# EAGLE design imon (EAGLE 7.7.0)
REVISION: 1.2
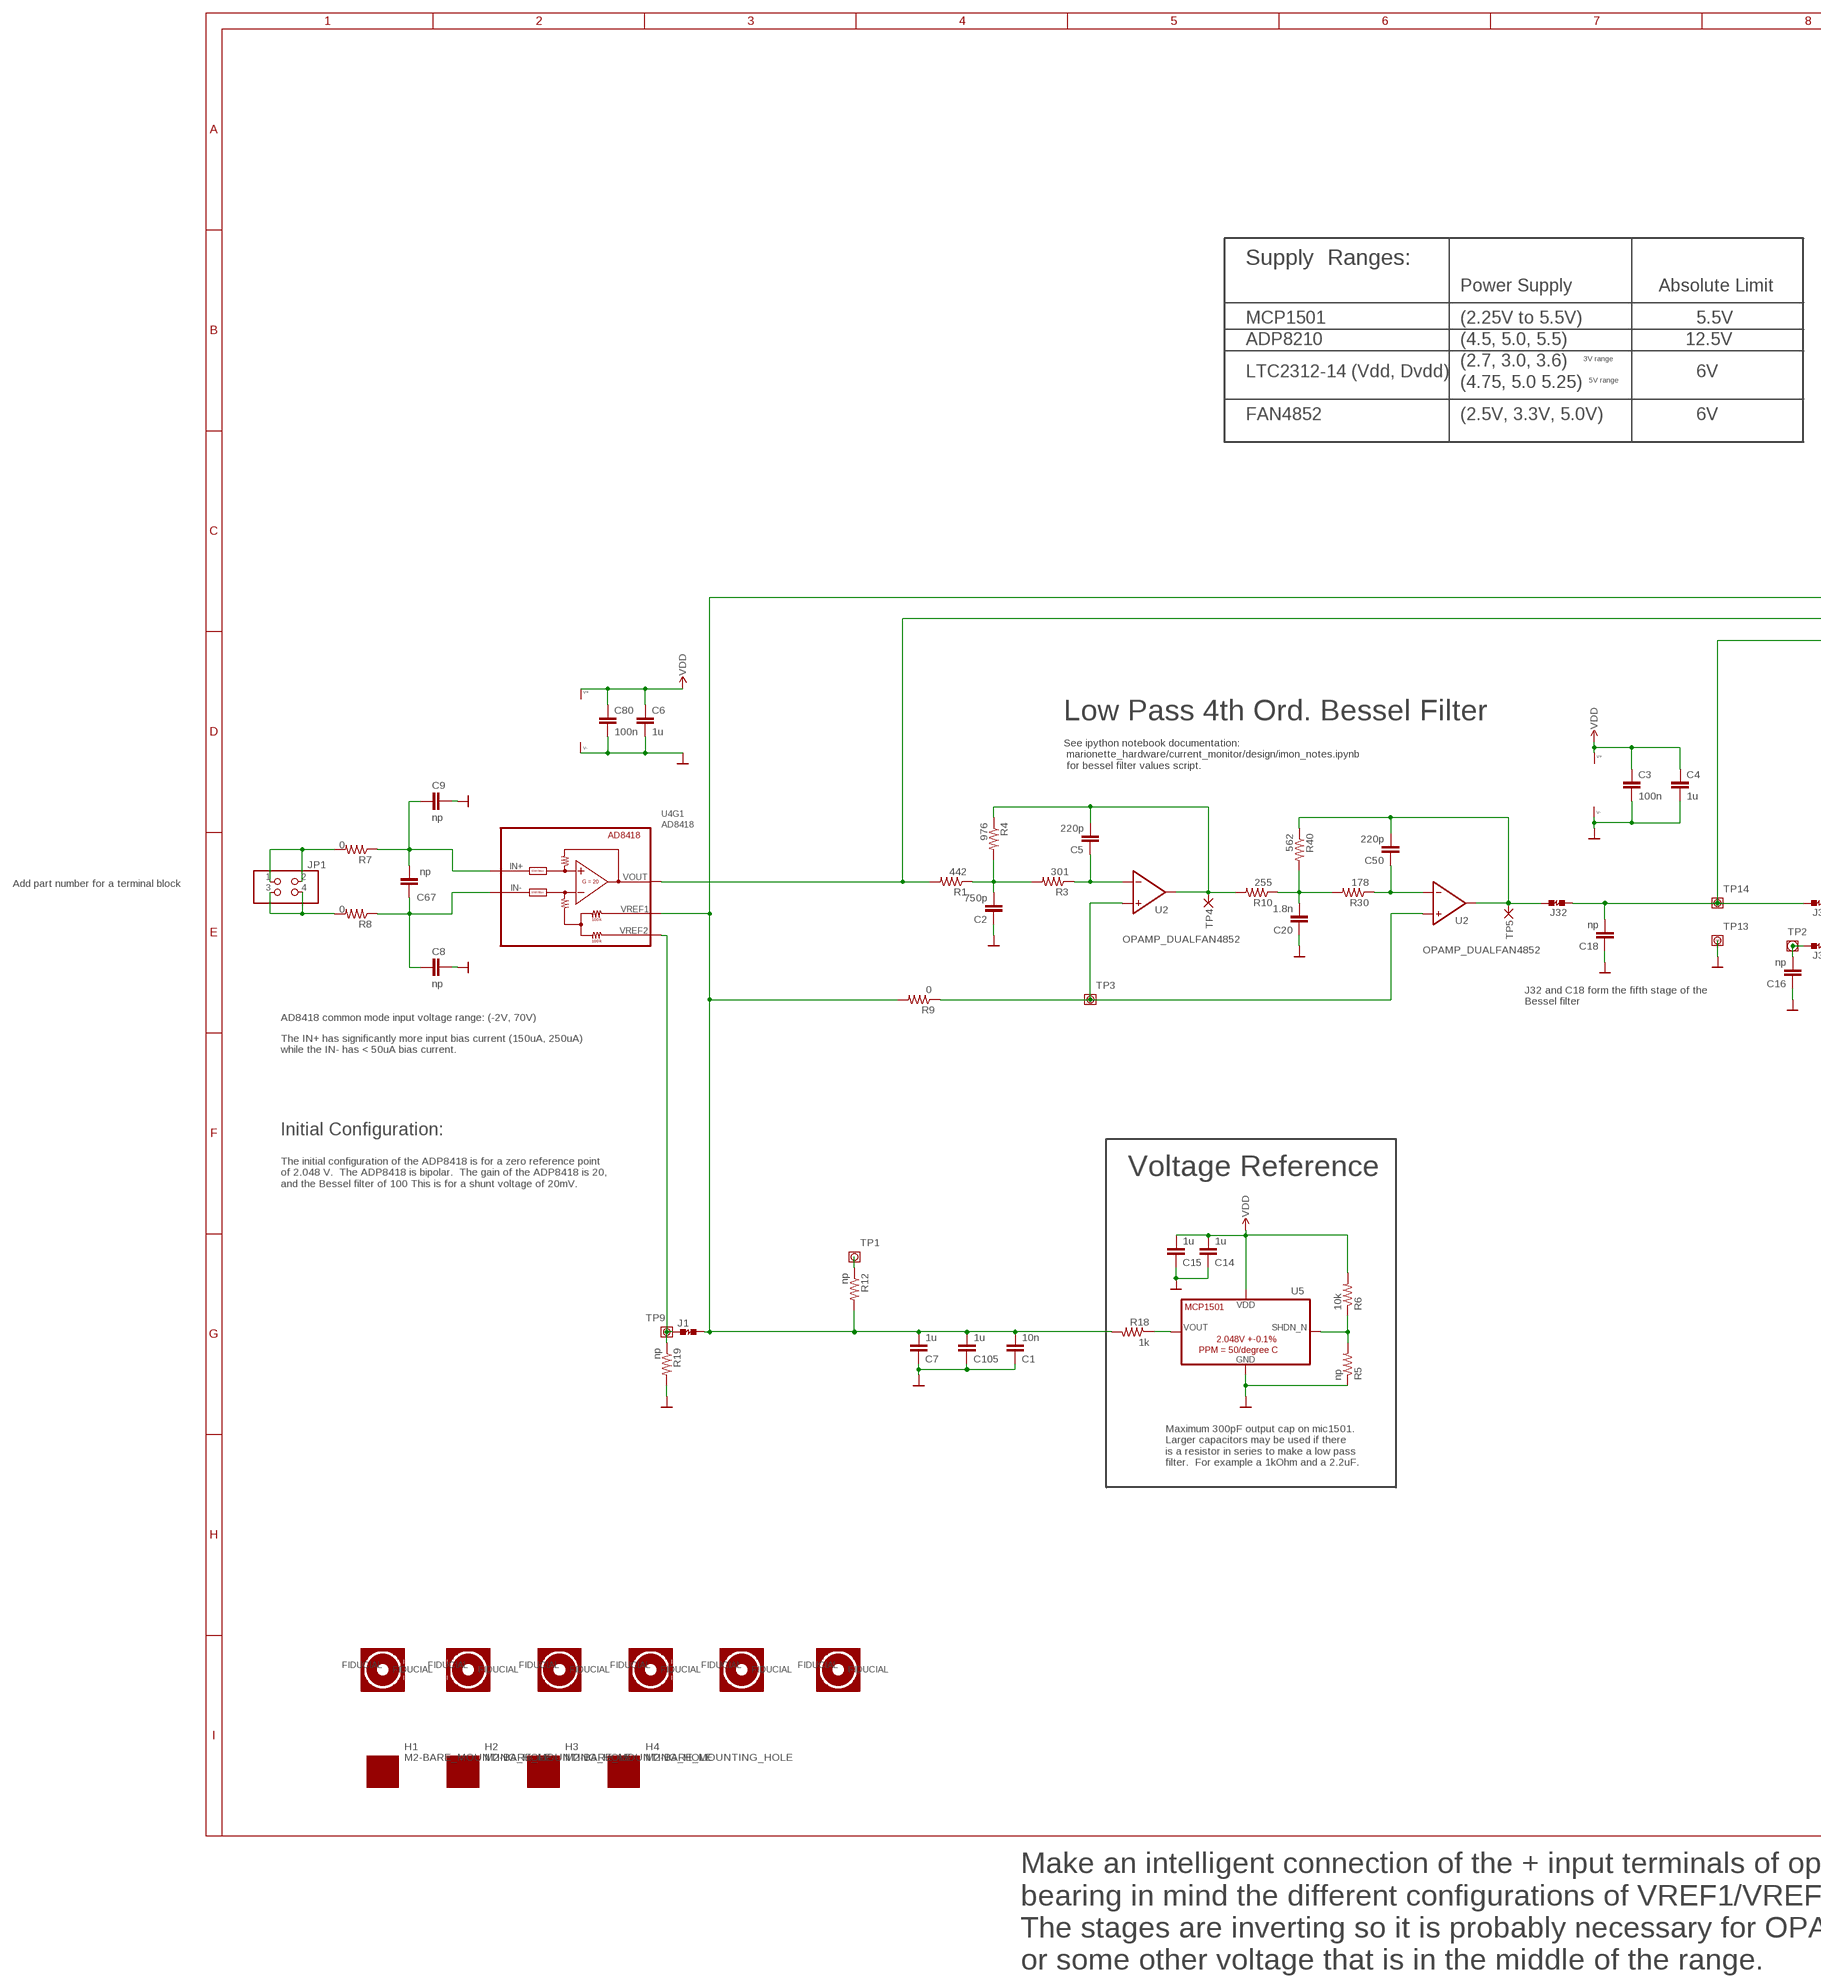
[diagram p0: schematic, sheet 1, part 1 of 2]
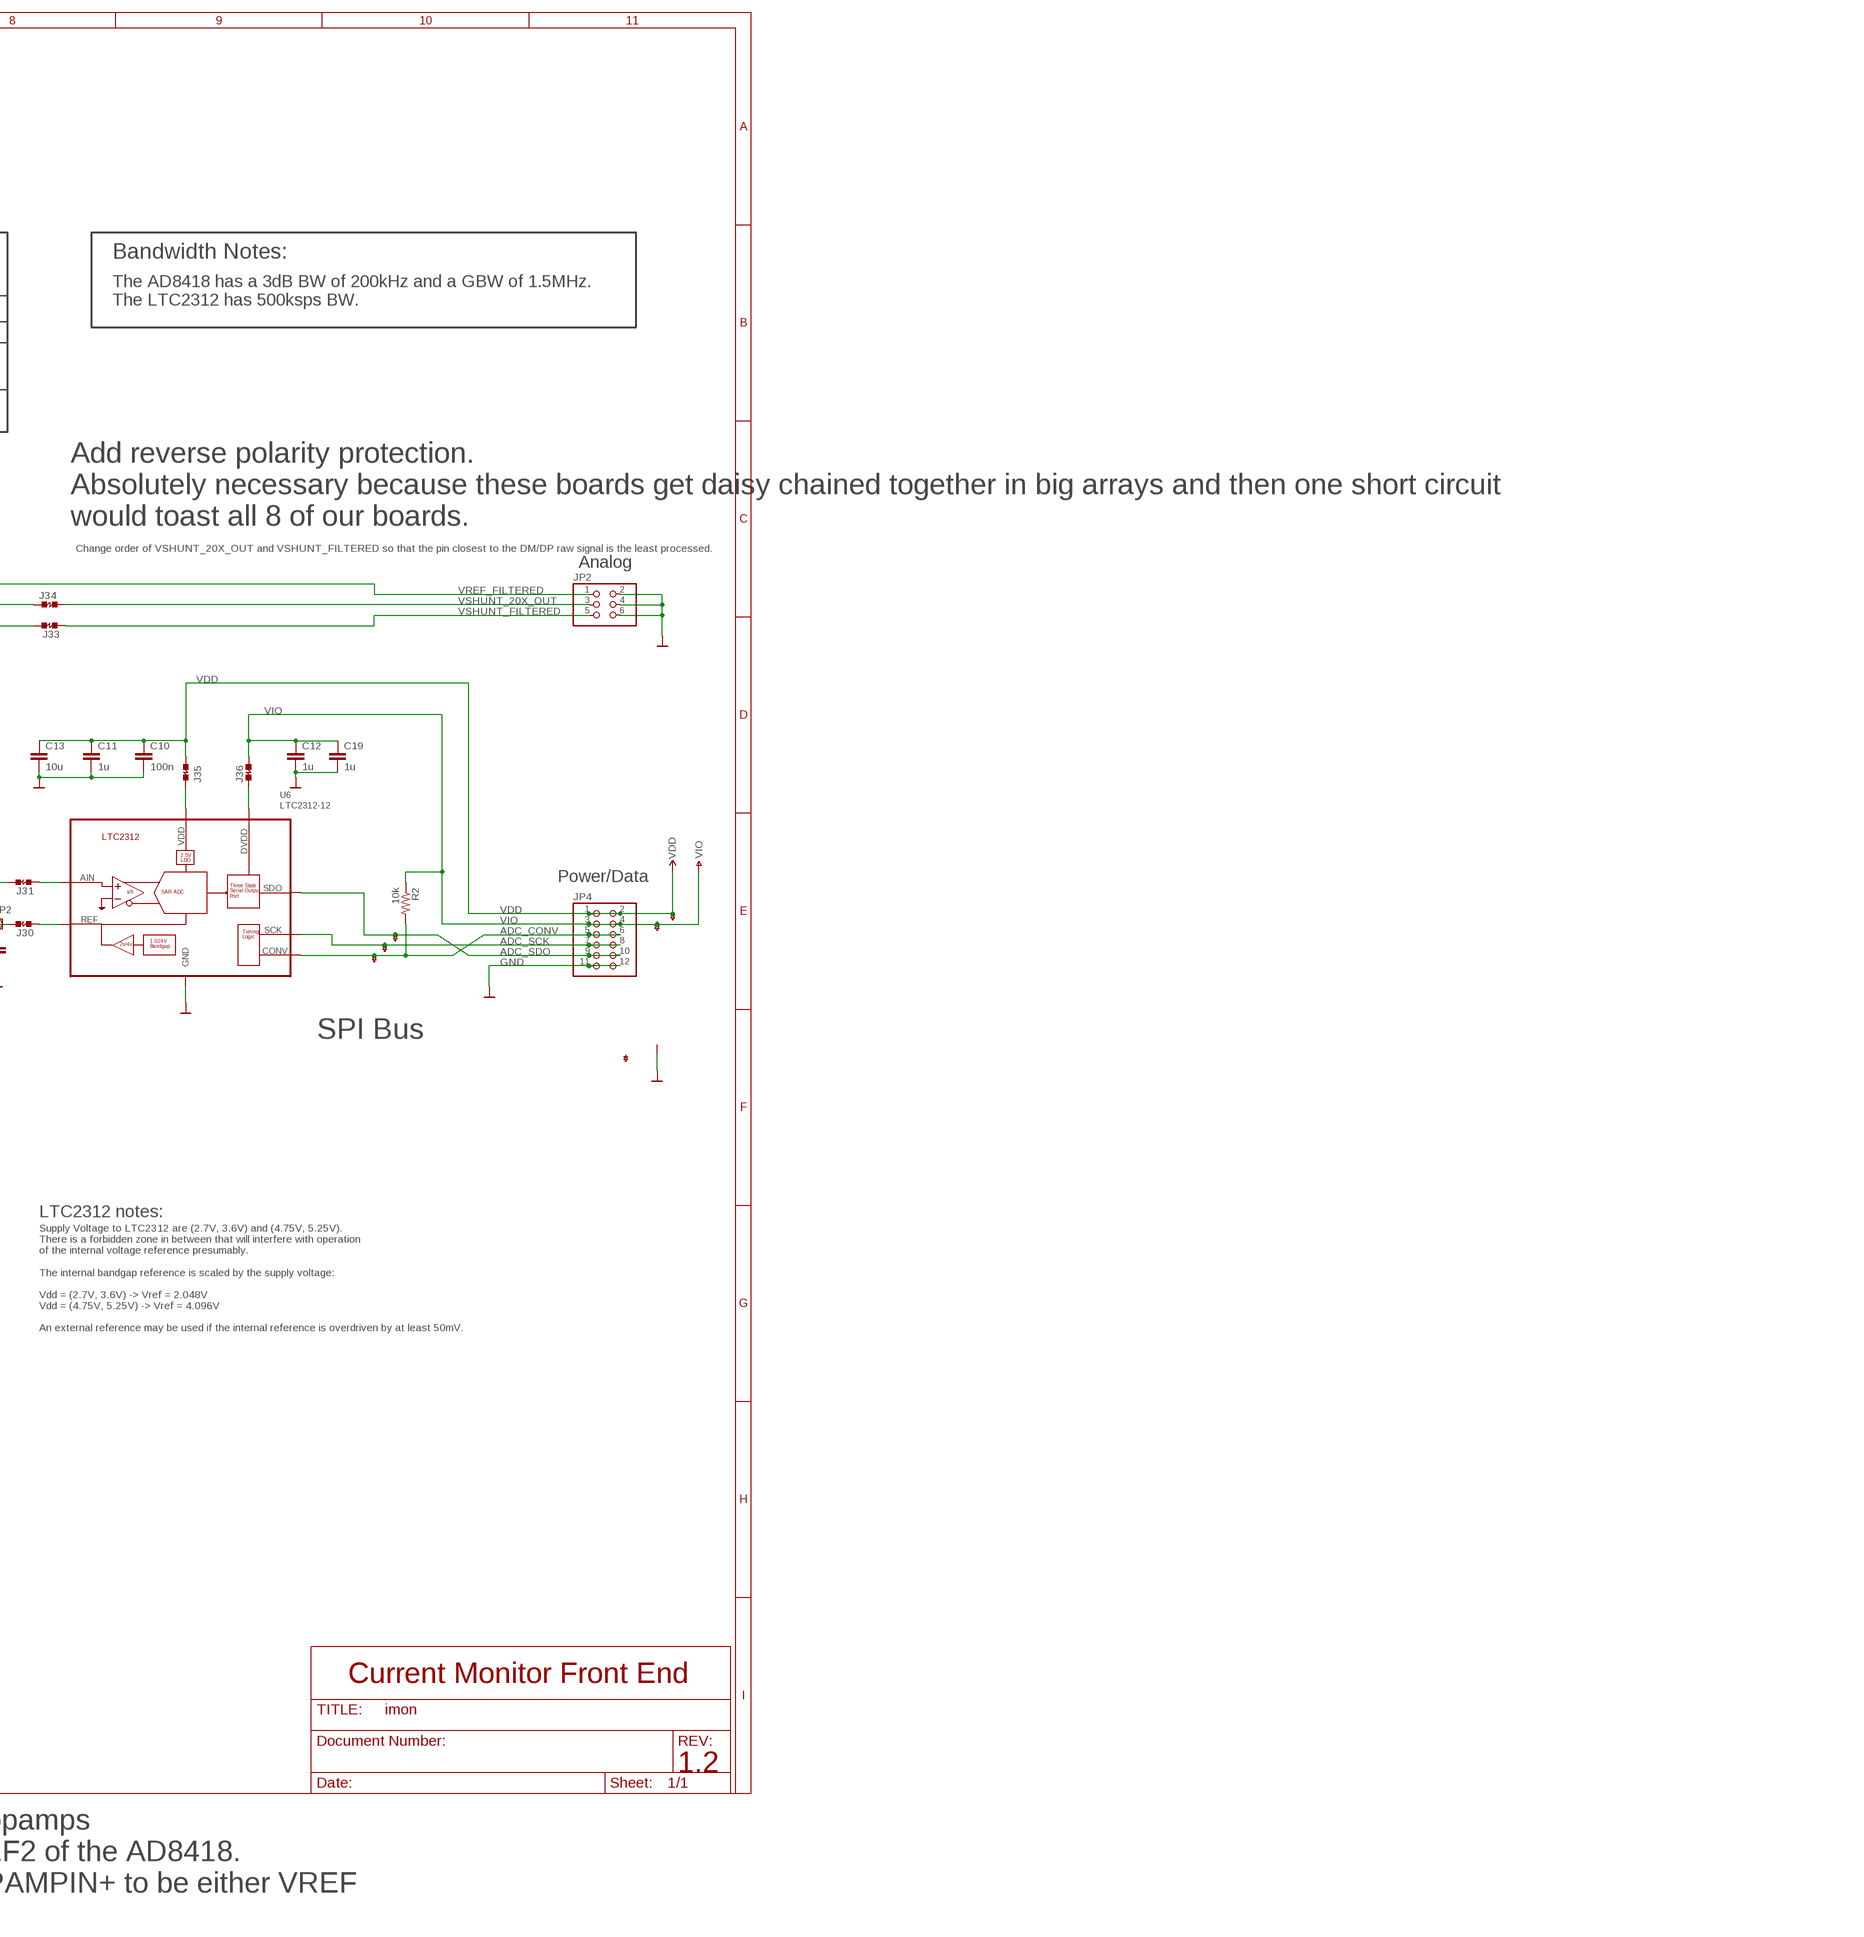
[diagram p1: schematic, sheet 1, part 2 of 2]

## Parts
C1  10n  C-EU0402-B  [.0402-B]
C2  750p  C-EU0402-B  [.0402-B]
C3  100n  C-EU0402-B  [.0402-B]
C4  1u  C-EU0402-B  [.0402-B]
C5  220p  C-EU0402-B  [.0402-B]
C6  1u  C-EU0402-B  [.0402-B]
C7  1u  C-EU0402-B  [.0402-B]
C8  np  C-EU0805-A-NOSILK  [.0805-A-NOSILK]
C9  np  C-EU0805-A-NOSILK  [.0805-A-NOSILK]
C10  100n  C-EU0402-B  [.0402-B]
C11  1u  C-EU0402-B  [.0402-B]
C12  1u  C-EU0402-B  [.0402-B]
C13  10u  C-EU0805-B  [.0805-B]
C14  1u  C-EU0402-B  [.0402-B]
C15  1u  C-EU0402-B  [.0402-B]
C16  np  C-EU0402-B  [.0402-B]
C18  np  C-EU0402-B  [.0402-B]
C19  1u  C-EU0402-B  [.0402-B]
C20  1.8n  C-EU0402-B  [.0402-B]
C50  220p  C-EU0402-B  [.0402-B]
C67  np  C-EU1206-0402  [1206-0402]
C80  100n  C-EU0402-B  [.0402-B]
C105  1u  C-EU0402-B  [.0402-B]
D1  ESD8006-ESD8006  [UDFN-8-3.3X1.0_6MIL]
FIDUCIAL1  FIDUCIAL-1.0X2.5  [FIDUCIAL-1.0X2.5]
FIDUCIAL2  FIDUCIAL-1.0X2.5  [FIDUCIAL-1.0X2.5]
FIDUCIAL3  FIDUCIAL-1.0X2.5  [FIDUCIAL-1.0X2.5]
FIDUCIAL4  FIDUCIAL-1.0X2.5  [FIDUCIAL-1.0X2.5]
FIDUCIAL5  FIDUCIAL-1.0X2.5  [FIDUCIAL-1.0X2.5]
FIDUCIAL6  FIDUCIAL-1.0X2.5  [FIDUCIAL-1.0X2.5]
H1  M2-BARE_MOUNTING_HOLE  [M2-BARE_MOUNTING_HOLE]
H2  M2-BARE_MOUNTING_HOLE  [M2-BARE_MOUNTING_HOLE]
H3  M2-BARE_MOUNTING_HOLE  [M2-BARE_MOUNTING_HOLE]
H4  M2-BARE_MOUNTING_HOLE  [M2-BARE_MOUNTING_HOLE]
J1  JUMPER-SHORTED-CUTTABLE-E0402-0.3MM  [JUMPER-SHORTED-CUTTABLE-E0402-0.3MM]
J30  JUMPER-SHORTED-CUTTABLE-E0402-0.3MM  [JUMPER-SHORTED-CUTTABLE-E0402-0.3MM]
J31  JUMPER-SHORTED-CUTTABLE-E0402-0.3MM  [JUMPER-SHORTED-CUTTABLE-E0402-0.3MM]
J32  JUMPER-SHORTED-CUTTABLE-E0402-0.3MM  [JUMPER-SHORTED-CUTTABLE-E0402-0.3MM]
J33  JUMPER-SHORTED-CUTTABLE-E0402-0.3MM  [JUMPER-SHORTED-CUTTABLE-E0402-0.3MM]
J34  JUMPER-SHORTED-CUTTABLE-E0402-0.3MM  [JUMPER-SHORTED-CUTTABLE-E0402-0.3MM]
J35  JUMPER-SHORTED-CUTTABLE-E0603-0.8MM  [JUMPER-SHORTED-CUTTABLE-E0603-0.8MM]
J36  JUMPER-SHORTED-CUTTABLE-E0603-0.8MM  [JUMPER-SHORTED-CUTTABLE-E0603-0.8MM]
JP1  PINHD-2X2  [2X02]
JP2  PINHD-2X3  [2X03]
JP4  PINHD-2X6/90  [2X06/90]
R1  442  R-US_0402-B  [.0402-B]
R2  10k  R-US_0402-B  [.0402-B]
R3  301  R-US_0402-B  [.0402-B]
R4  976  R-US_0402-B  [.0402-B]
R5  np  R-US_0402-B  [.0402-B]
R6  10k  R-US_0402-B  [.0402-B]
R7  0  R-US_1206-0402  [1206-0402]
R8  0  R-US_1206-0402  [1206-0402]
R9  0  R-US_0402-B  [.0402-B]
R10  255  R-US_0402-B  [.0402-B]
R12  np  R-US_0402-B  [.0402-B]
R18  1k  R-US_0402-B  [.0402-B]
R19  np  R-US_0402-B  [.0402-B]
R30  178  R-US_0402-B  [.0402-B]
R40  562  R-US_0402-B  [.0402-B]
TP1  PAD+VIA_0.25MM  [PAD+VIA_0.25MM]
TP2  PAD+VIA_0.6MM  [PAD+VIA_0.6MM]
TP3  PAD+VIA_0.3302MM  [PAD+VIA_0.3302MM]
TP4  PAD+X-1.0-NO_CREAM+SILK  [PAD-ROUND-1.0-NOCREAM+SILK]
TP5  PAD+X-1.0-NO_CREAM+SILK  [PAD-ROUND-1.0-NOCREAM+SILK]
TP9  PAD+VIA_0.25MM  [PAD+VIA_0.25MM]
TP13  PAD+VIA_GND_0.25MM  [PAD+GND_VIA_0.25MM]
TP14  PAD+VIA_0.25MM  [PAD+VIA_0.25MM]
U2  OPAMP_DUALFAN4852  [MSOP-8]
U4  AD8418  [SOIC-8_BETTER_TOE]
U5  MCP1501"  [SOT23-6]
U6  LTC2312-12  [TSOT23-8]

## Nets
AD8418_REF2: J1.1 R19.1 TP9.TP U4.3(VREF2)
ADC_AIN: J31.1 U6.4(AIN)
ADC_CONV: D1.4 JP4.5 JP4.6 R2.2 U6.8(CONV)
ADC_SCK: D1.2 JP4.7 JP4.8 U6.7(SCK)
ADC_SDO: D1.1 JP4.9 JP4.10 U6.6(SDO)
ADC_VREF: C16.2 J30.2 TP2.TP
ADC_VREF_CUTTABLE: J30.1 U6.2(REF)
FILTER1-: C5.1 R3.1 U2.2(-IN)
FILTER2-: C50.1 R30.1 U2.6(-IN)
FILTER_1_OUT: C5.2 R4.1 R10.2 TP4.PAD(P) U2.1(OUT)
FILTER_1_V1: C2.2 R1.1 R3.2 R4.2
FILTER_2_OUT: C50.2 J32.2 R40.1 TP5.PAD(P) U2.7(OUT)
FILTER_2_V1: C20.2 R10.1 R30.2 R40.2
GND: C1.1 C2.1 C3.2 C4.2 C6.2 C7.1 C8.1 C9.1 C10.2 C11.2 C12.2 C13.2 C14.1 C15.1 C16.1 C18.1 C19.2 C20.1 C80.2 C105.1 D1.3 D1.6 D1.9 D1.10 JP2.2 JP2.4 JP2.6 JP4.11 JP4.12 R5.1 R19.2 TP13.TP U2.4(V-) U4.2(V-) U5.2(GND) U5.3(GND) U5.5(GND) U6.3(GND)
MCP1501_SHDN_N: R5.2 R6.1 U5.4(SHDN_N)
OPAMP_IN+: R9.1 TP3.TP U2.3(+IN) U2.5(+IN)
V3.3D_CUTTABLE: J36.1 U6.5(DVDD)
V5D_CUTTABLE: J35.1 U6.1(VDD)
VDD: C3.1 C4.1 C6.1 C10.1 C11.1 C13.1 C14.2 C15.2 C80.1 D1.8 J35.2 JP4.1 JP4.2 R6.2 U2.8(V+) U4.6(V+) U5.6(VDD)
VIO: C12.1 C19.1 D1.7 J36.2 JP4.3 JP4.4 R2.1
VREF_FILTERED: C1.2 C7.2 C105.2 J1.2 JP2.1 R9.2 R12.2 R18.2 U4.7(VREF1)
VREF_OPTIONAL: R12.1 TP1.TP
VREF_OUT: R18.1 U5.1(VOUT)
VSHUNT_20X: J34.1 R1.2 U4.5(VOUT)
VSHUNT_20X_OUT: J34.2 JP2.3
VSHUNT_FILTERED: J33.1 JP2.5
VSHUNT_FILTERED_ADC: C18.2 J31.2 J32.1 J33.2 TP14.TP
VSHUNT_FILTERED_M: C8.2 C67.1 R8.1 U4.1(IN-)
VSHUNT_FILTERED_P: C9.2 C67.2 R7.1 U4.8(IN+)
VSHUNT_M: JP1.3 JP1.4 R8.2
VSHUNT_P: JP1.1 JP1.2 R7.2
Unconnected: D1.5 FIDUCIAL1.FIDUCIAL FIDUCIAL2.FIDUCIAL FIDUCIAL3.FIDUCIAL FIDUCIAL4.FIDUCIAL FIDUCIAL5.FIDUCIAL FIDUCIAL6.FIDUCIAL

## Notes on the sheet
- Supply  Ranges: | Bandwidth Notes:
- Power Supply | Absolute Limit
- The AD8418 has a 3dB BW of 200kHz and a GBW of 1.5MHz.
  The LTC2312 has 500ksps BW.
- MCP1501 | (2.25V to 5.5V) | 5.5V
- ADP8210 | (4.5, 5.0, 5.5) | 12.5V
- 3V range
- (2.7, 3.0, 3.6)
- LTC2312-14 (Vdd, Dvdd) | 6V
- 5V range
- (4.75, 5.0 5.25)
- FAN4852 | (2.5V, 3.3V, 5.0V) | 6V
- Add reverse polarity protection.
  Absolutely necessary because these boards get daisy chained together in big arrays and then one short circuit
  would toast all 8 of our boards.
- Change order of VSHUNT_20X_OUT and VSHUNT_FILTERED so that the pin closest to the DM/DP raw signal is the least processed.
- Analog
- Low Pass 4th Ord. Bessel Filter
- See ipython notebook documentation:
   marionette_hardware/current_monitor/design/imon_notes.ipynb
   for bessel filter values script.
- Add part number for a terminal block
- Power/Data
- J32 and C18 form the fifth stage of the
  Bessel filter
- AD8418 common mode input voltage range: (-2V, 70V)
- The IN+ has significantly more input bias current (150uA, 250uA)
  while the IN- has < 50uA bias current.
- SPI Bus
- Initial Configuration:
- Voltage Reference
- The initial configuration of the ADP8418 is for a zero reference point
  of 2.048 V.  The ADP8418 is bipolar.  The gain of the ADP8418 is 20,
  and the Bessel filter of 100 This is for a shunt voltage of 20mV.
- LTC2312 notes:
- Supply Voltage to LTC2312 are (2.7V, 3.6V) and (4.75V, 5.25V). 
  There is a forbidden zone in between that will interfere with operation
  of the internal voltage reference presumably.
- The internal bandgap reference is scaled by the supply voltage:
  
  Vdd = (2.7V, 3.6V) -> Vref = 2.048V
  Vdd = (4.75V, 5.25V) -> Vref = 4.096V
  
  An external reference may be used if the internal reference is overdriven by at least 50mV.
- Maximum 300pF output cap on mic1501.
  Larger capacitors may be used if there
  is a resistor in series to make a low pass
  filter.  For example a 1kOhm and a 2.2uF.
- Current Monitor Front End
- Make an intelligent connection of the + input terminals of opamps
  bearing in mind the different configurations of VREF1/VREF2 of the AD8418.  
  The stages are inverting so it is probably necessary for OPAMPIN+ to be either VREF
  or some other voltage that is in the middle of the range.

## Library data of the parts
C1-C16 C18-C20 C50 C67 C80 C105 = rcl_custom:C-EU: CAPACITOR, European symbol
D1 = marionette:ESD8006: TVS protection 6 diode array Vrwv = 3.3V, Vbr = (5.5V typ, 7.0V max), Onsemi ESD8006, Digikey No. ESD8006MUTAGOSCT-ND 6mil trace/space
FIDUCIAL1-FIDUCIAL6 = marionette:FIDUCIAL: Fiducials for optical coordinate reference
H1-H4 = marionette:M2-BARE_MOUNTING_HOLE
J1 J30-J34 = marionette:JUMPER-SHORTED-CUTTABLE: A normally shorted PCB jumper with a thin cuttable trace that can be patched with an additional component. This device will generate 4 overlap errors in the DRC.; NO_MNT: 1
J35 J36 = marionette:JUMPER-SHORTED-CUTTABLE: A normally shorted PCB jumper with a thin cuttable trace that can be patched with an additional component. This device will generate 4 overlap errors in the DRC.
JP1 = pinhead:PINHD-2X2: PIN HEADER
JP2 = pinhead:PINHD-2X3: PIN HEADER
JP4 = pinhead:PINHD-2X6: PIN HEADER
R1-R10 R12 R18 R19 R30 R40 = rcl_custom:R-US_: RESISTOR, American symbol
TP1 TP9 TP14 = marionette:PAD+VIA_0.25MM: testpad via with 0.25mm dia hole
TP2 = marionette:PAD+VIA_0.6MM: testpad with 0.6mm dia via
TP3 = dock_v2:PAD+VIA_0.3302MM: 0.3302mm or 13mil diameter testpad with via
TP4 TP5 = marionette:PAD+X: Test Pad
TP13 = marionette:PAD+VIA_GND_0.25MM: Pad with via and square tplace marking to readily distinguish this testpad as a GND via.
U2 = marionette:OPAMP_DUAL: Op Amps Dual Package MC4558, dual op amp, Vin = +-2V to 20V, GBW = 5.5MHz, Pkg: SOIC-8, Mfg.: ST, Mfg_Part_No.: MC4558CDT; Digikey Part No.: 497-4051-1-ND, note this part has poor datasheet, check input voltage range. FAN4852, dual op amp, rail to rail outputs, (-0.1V, 2.1V input range), Supply range = (2.5V, 5V), GBW = 9MHz, Pkg.: MSOP-8, Mfg: Fairchild, MPN: FAN4852IMU8X, DPN.: FAN4852IMU8XCT-ND; DPN: FAN4852IMU8XCT-ND
U4 = marionette:AD8418: Current Sense Amplifier Mfg.: Analog, Pkg.: SOIC-8, MPN: AD8418WBRZ, DPN: AD8418WBRZ-ND; DPN: AD8418WBRZ-ND
U5 = marionette:MCP1501: Voltage Reference mfg: Microchip, pkg.: SOT23-6 Vref = 3.0V, MPN: MCP1501T-30E/CHY, DPN: MCP1501T-30E/CHYCT-ND Vref = 2.048V, MPN: MCP1501T-20E/CHY, DPN: MCP1501T-20E/CHYCT-ND; DPN: MCP1501T-20E/CHYCT-ND; PPM: 50/degree C; VREF: 2.048V +-0.1%
U6 = marionette:LTC2312-12: ADC, 12bit, 500ksps LTC2312-12, mfg.: Linear, pkg.: TSOT23-8 (TS8), mfg part no.: LTC2312CTS8-12#TRMPBF, Digikey part no.: LTC2312CTS8-12#TRMPBFCT-ND; DPN: LTC2312CTS8-12#TRMPBFCT-ND

## Board
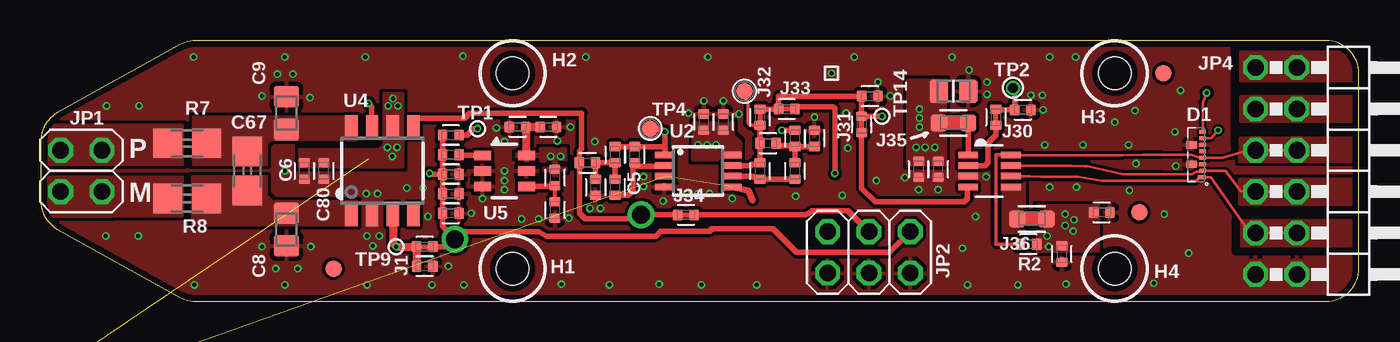
[diagram p2: board, top side]
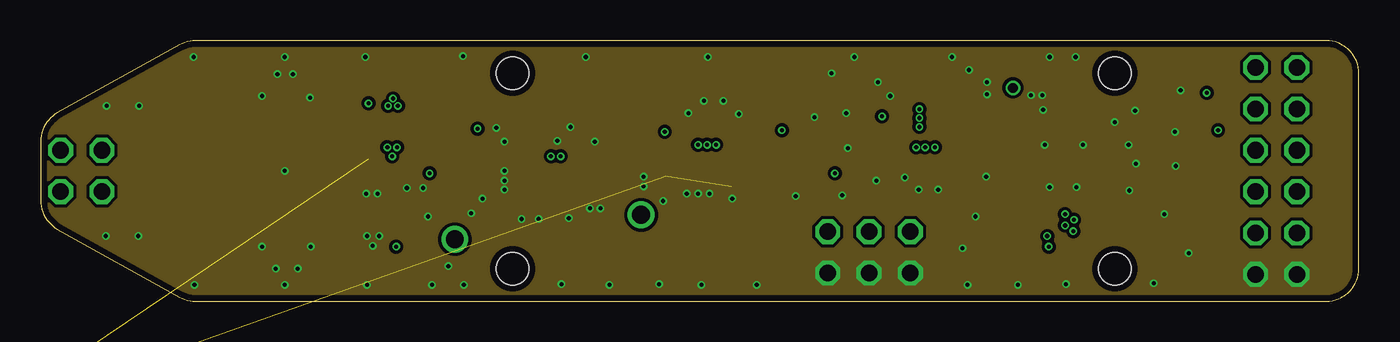
[diagram p3: board, inner layer Route2]
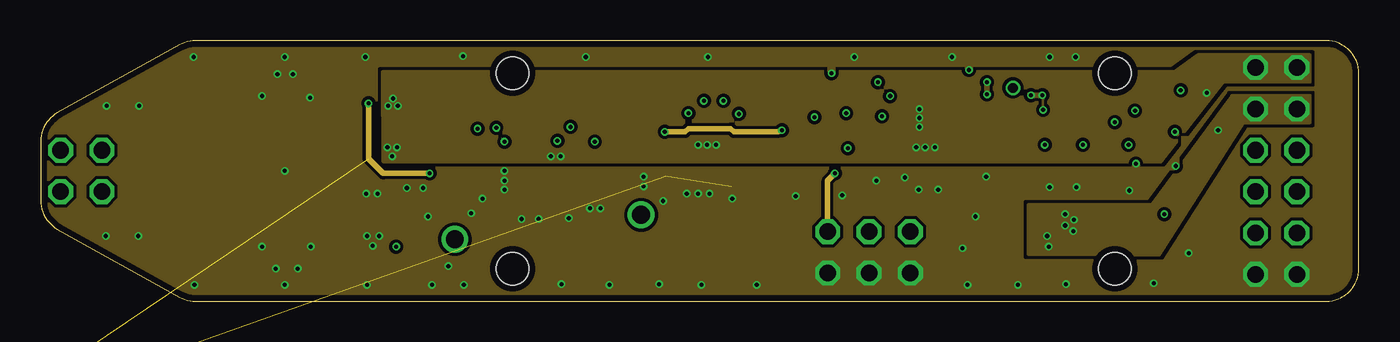
[diagram p4: board, inner layer Route3]
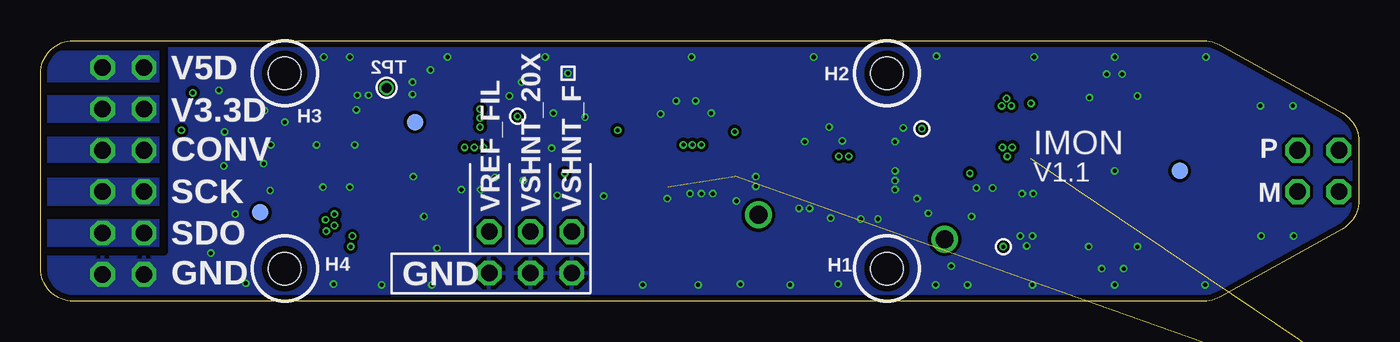
[diagram p5: board, bottom side, seen from below]

Size 81 x 16 mm. Coordinates in mm from the lower left corner, seen from the top.
Outline: 8.55,15.75 1.03,11.57 arc61 0,9.82 0,6.18 arc61 1.03,4.43 8.55,0.25 arc29 9.52,0 79,0 arc90 81,2 81,14 arc90 79,16 9.52,16 arc29 8.55,15.75
Copper layers (1*2*3*16): Top 0.035559375mm / dielectric 0.17018125mm / Route2 0.01778125mm / dielectric 47mil / Route3 0.0356mm / dielectric 0.2007mm / Bottom 0.035559375mm
Design rules "oshpark_4lyr *": minimum track width 5mil, minimum drill 10mil, track to track 6mil, track to pad 6mil, pad to pad 6mil, via to via 6mil, smd to smd 6mil, copper to edge 15mil, drill to drill 6mil, minimum pad ring 4mil, minimum via ring 4mil, stop-mask expansion 4mil, vias tented up to drill 0mil, thermal gap 10mil
tRestrict: 3 lines
bRestrict: 2 lines

### Footprints (pad centres in the part's own frame; a part is rotated, then mirrored left to right if it is on the bottom)
.0402-B = smd 0.6 x 0.7: 1 -0.5,0; 2 0.5,0
.0805-A-NOSILK = smd 1.35 x 1.55: 1 -1,0; 2 1,0
.0805-B = smd 1.15 x 1.45: 1 -0.9,0; 2 0.9,0
1206-0402 = smd 1.8 x 1.8: 1 -1.2,0; 2 1.2,0
UDFN-8-3.3X1.0_6MIL = smd 0.25 x 0.5: 1 -1.4,-0.35 | smd 0.25 x 0.4: 2 -1,-0.4; 3 -0.6,-0.4; 4 -0.2,-0.4; 5 0.2,-0.4; 6 0.6,-0.4; 7 1,-0.4; 8 1.4,-0.4 | smd 0.44 x 0.65: 9 0.595,0.275; 10 -0.595,0.275
FIDUCIAL-1.0X2.5 = smd 1 x 1: FIDUCIAL 0,0
M2-BARE_MOUNTING_HOLE = hole 2: 0,0
JUMPER-SHORTED-CUTTABLE-E0402-0.3MM = smd 0.6 x 0.7: 1 -0.5,0; 2 0.5,0
JUMPER-SHORTED-CUTTABLE-E0603-0.8MM = smd 1 x 1.05: 1 -0.9,0; 2 0.9,0
2X02 = drill 1.016 octagon: 1 -1.27,-1.27; 2 -1.27,1.27; 3 1.27,-1.27; 4 1.27,1.27
2X03 = drill 1.016 octagon: 1 -2.54,-1.27; 2 -2.54,1.27; 3 0,-1.27; 4 0,1.27; 5 2.54,-1.27; 6 2.54,1.27
2X06/90 = drill 1.016 octagon: 1 -6.35,-6.35; 2 -6.35,-3.81; 3 -3.81,-6.35; 4 -3.81,-3.81; 5 -1.27,-6.35; 6 -1.27,-3.81; 7 1.27,-6.35; 8 1.27,-3.81; 9 3.81,-6.35; 10 3.81,-3.81; 11 6.35,-6.35; 12 6.35,-3.81
PAD+VIA_0.25MM = drill 0.25: TP 0,0
PAD+VIA_0.6MM = drill 0.6: TP 0,0
PAD+VIA_0.3302MM = drill 0.33: TP 0,0
PAD-ROUND-1.0-NOCREAM+SILK = smd 1 x 1: PAD 0,0
PAD+GND_VIA_0.25MM = drill 0.25: TP 0,0
MSOP-8 = smd 0.4 x 1.2: 1 -0.975,-2.05; 2 -0.325,-2.05; 3 0.325,-2.05; 4 0.975,-2.05; 5 0.975,2.05; 6 0.325,2.05; 7 -0.325,2.05; 8 -0.975,2.05
SOIC-8_BETTER_TOE = smd 0.762 x 1.443: 1 -1.905,-2.69; 2 -0.635,-2.69; 3 0.635,-2.69; 4 1.905,-2.69; 5 1.905,2.69; 6 0.635,2.69; 7 -0.635,2.69; 8 -1.905,2.69
SOT23-6 = smd 0.6 x 1.05: 1 -0.95,-1.35; 2 0,-1.35; 3 0.95,-1.35; 4 0.95,1.35; 5 0,1.35; 6 -0.95,1.35
TSOT23-8 = smd 0.4 x 1.22: 1 -0.975,-1.31; 2 -0.325,-1.31; 3 0.325,-1.31; 4 0.975,-1.31; 5 0.975,1.31; 6 0.325,1.31; 7 -0.325,1.31; 8 -0.975,1.31

### Placement (x,y rotation side)
C1  25.2,6.6 180 top
C2  34.1,7 90 top
C3  41.95,11 90 top
C4  40.75,11 90 top
C5  36.5,9 90 top
C6  16.2,8 270 top
C7  25.2,7.8 180 top
C8  15.1,4.4 90 top
C9  15.1,11.55 270 top
C10  55.15,8.1 270 top
C11  53.95,8.1 270 top
C12  65.2,5.45 0 top
C13  56.1,12.9 0 top
C14  31.2,10.7 180 top
C15  29.3,10.7 0 top
C16  60.35,11.75 180 top
C18  50.95,12.6 180 top
C19  62.75,2.9 270 top
C20  47.55,10 270 top
C50  44.2,8 90 top
C67  12.7,8 90 top
C80  17.4,8 270 top
C105  25.2,5.4 180 top
D1  71,9 90 top
FIDUCIAL1  58,11 0 bottom
FIDUCIAL2  67.5,5.45 0 bottom
FIDUCIAL3  11,8 0 bottom
FIDUCIAL4  69,14 0 top
FIDUCIAL5  67.5,5.45 0 top
FIDUCIAL6  18,2 0 top
H1  29,2 0 top
H2  29,14 0 top
H3  66,14 0 top
H4  66,2 0 top
J1  23.6,3.35 0 top
J30  58.7,11.3 90 top
J31  50.45,10.85 90 top
J32  44.2,11.3 270 top
J33  45.85,11.8 180 top
J34  39.65,5.3 0 top
J35  56.1,10.95 180 top
J36  60.9,5.05 0 top
JP1  2.5,8 270 top
JP2  50.9,3 180 top
JP4  81,8 270 top
R1  33.6,8.5 180 top
R2  60.7,3.5 180 top
R3  35.3,7 90 top
R4  35.3,9 270 top
R5  31.6,5.6 90 top
R6  31.6,7.6 90 top
R7  9,9.7 180 top
R8  9,6.3 180 top
R9  -5.05,-7.9 0 top  (outside the outline)
R10  46.35,10 90 top
R12  25.2,10.2 180 top
R18  25.2,9 180 top
R19  23.6,2.15 0 top
R30  46.35,8 90 top
R40  44.7,9.7 0 top
TP1  26.85,10.6 0 top
TP2  59.75,13.1 0 top
TP3  -3.7,-12.7 0 top  (outside the outline)
TP4  37.45,10.6 0 top
TP5  43.25,12.9 0 top
TP9  21.85,3.35 0 top
TP13  48.6,14 180 top
TP14  51.7,11.35 180 top
U2  40.4,8 270 top
U4  21,8 0 top
U5  28.5,8 270 top
U6  58.3,8 270 top

### Tracks (layer width: path | path; a pad name or v marks a point on that pad's centre or on a via)
AD8418_REF2
  Top 0.35: 21.6,5.3 21.62,5.3 U4.3
  Top 0.5: 21.6,5.3 21.65,5.15 21.65,3.55 TP9.TP J1.1 R19.1
ADC_AIN
  Top 0.35: 56.8,7 56.9,7.04 U6.4 56.95,6.99 56.95,6.3 56.75,6.1 51.3,6.1 50.45,6.95 50.45,11.35
ADC_CONV
  Top 0.15: U6.8 66.47,8.97 | 66.47,8.97 66.45,8.95 | 66.47,8.97 67.75,9 70.7,9 71.15,8.85 71.25,8.85 71.3,8.8 D1.4 72.65,8.8 74.1,9.25 74.63,9.25 JP4.5 JP4.6
  Top 0.2: R2.2 58.7,3.5 58.7,9 59.61,9 U6.8
  pour Bottom (isolate 0.25, no thermals): 73.7,10 80.95,10 80.95,8.6 73.7,8.6
  pour Top (isolate 0.25, no thermals): 73.7,10 80.95,10 80.95,8.6 73.7,8.6
ADC_SCK
  Top 0.15: U6.7 63.33,8.32 62.7,8.32 64.15,8.3 64.35,8.3 66.5,7.8 70.75,7.8 71,7.95 71.35,7.95 D1.2 72.8,8 73.75,6.75 74.63,6.75 JP4.7 JP4.8
  pour Bottom (isolate 0.25, no thermals): 73.7,7.5 80.95,7.5 80.95,5.95 73.7,5.95
  pour Top (isolate 0.25, no thermals): 73.7,7.5 81,7.5 81,5.95 73.7,5.95
ADC_SDO
  Top 0.15: U6.6 60.77,7.67 61.5,7.65 63.75,7.65 65.2,7.4 71,7.4 71.2,7.6 D1.1 71.9,7.6 74.3,4.2 JP4.9 JP4.10
  pour Bottom (isolate 0.25, no thermals): 73.65,4.95 80.95,4.95 80.95,3.35 73.65,3.35
  pour Top (isolate 0.25, no thermals): 73.8,4.95 81,4.95 81,3.4 73.75,3.4 73.75,4.95
ADC_VREF
  Top 0.35: J30.2 58.75,11.75 C16.2 59.85,13 TP2.TP
ADC_VREF_CUTTABLE
  Top 0.35: U6.2 58.02,8.32 58.2,8.5 58.2,9.7 58.7,10.2 J30.1
FILTER1-
  Top 0.35: R3.1 36.1,6.5 36.4,6.8 36.4,8.4 C5.1 36.5,8.3 38.33,8.3 U2.2
FILTER2-
  Top 0.35: U2.6 43.73,7.67 43.8,7.6 44.1,7.6 C50.1 R30.1
FILTER_1_OUT  (via drill 0.25)
  Top 0.35: U2.1 38.35,9.5 | 38.35,9.5 v38.35,10.4 38.1,10.6 TP4.PAD | R4.1 C5.2 38.35,9.5 | v45.55,10.5 R10.2
  Route3 0.35: v38.35,10.4 39.6,10.4 39.8,10.6 42.4,10.6 42.6,10.4 45.3,10.4 v45.55,10.5
FILTER_1_V1
  Top 0.35: C2.2 R1.1 R4.2 R3.2
FILTER_2_OUT
  Top 0.2: TP5.PAD 43.45,12.1 43.45,10.95 43.6,10.8 44.1,10.8 44.2,10.7
  Top 0.35: J32.2 44.2,10.7 R40.1 C50.2 44.1,8.4 43.7,8.4 43.62,8.32 U2.7
FILTER_2_V1
  Top 0.35: R40.2 45.2,9.65 45.3,9.55 46.3,9.55 R10.1 | R10.1 R30.2 | R10.1 C20.2
GND  (via drill 0.25, 0.25 pad 0.25, 0.25 pad 0.33)
  other vias: 20.05,4 20.8,4 20,6.6 20.7,6.6 20.4,3.4 28.5,8 28.5,7.4 28.5,9.8 28,10.65 31.75,9.85 32.55,10.7 41.1,6.6 39.7,6.6 40.4,6.6 23.5,6.95 23.8,5.2 49.25,6.5 53.1,7.6 69.75,8.3 69.7,10.4 66,11 67.3,8.45 34.95,1 40.6,1 33.75,5.7 30.6,5.05 28.5,6.85 55.15,6.85 53.95,6.85 42.5,6.3 38,1.05 32,1.05 26,1 20.05,1 15,1 9.45,1 4,4 6,4 4.05,12 6.05,12 9.4,15 15,15 19.95,15 25.95,15.05 33.5,15 34.05,9.8 41,15 50,15 56,15 62,15 63.6,15 60.05,1 70.05,12.95 69.05,5.35 70.55,2.95 67.25,11.7 68.4,1.1 63,1.05 56.95,1 62,7 63.65,7 66.9,6.8 66.85,9.6 64.05,9.6 61.7,9.6 57.45,5.2 56.65,3.25 22.5,6.95 16.6,3.35 16.55,12.5 38.25,6.15 29.55,5.05 57.05,14.2 52.2,12.6 27.15,6.3 26.45,5.4 34.4,5.7 32.45,5.1 61.55,12.65 61.6,11.75 60.85,12.65 37.05,7.65 37.05,7.05 51.45,13.45 58.15,12.7 58.15,13.45 58.1,7.65 13.6,3.35 14.45,2 15.8,2 15.5,13.95 14.55,13.95 13.6,12.6 39.8,11.55 42.9,11.5 40.75,12.3 41.95,12.3 49.6,9.4 49.5,11.55 51.35,7.4 24.05,1 25.05,2.15 44,1 47.55,11.3 46.4,6.45 15,8
  pour Top (isolate 0.2, rank 5): 79,0 9.52,0 arc-29 8.55,0.25 1.03,4.43 arc-61 0,6.18 0,9.82 arc-61 1.03,11.57 8.55,15.75 arc-29 9.52,16 79,16 arc-90 81,14 81,2 arc-90
  pour Bottom (isolate 0.2, rank 5): 79,0 9.52,0 arc-29 8.55,0.25 1.03,4.43 arc-61 0,6.18 0,9.82 arc-61 1.03,11.57 8.55,15.75 arc-29 9.52,16 79,16 arc-90 81,14 81,2 arc-90
  pour Top (isolate 0.2, rank 4, no thermals): 15.65,8 15.65,7 19.55,7 19.6,3.05 21.1,3.05 21.1,8
  pour Route2 (isolate 0.2, rank 5, no thermals): 79,0 9.52,0 arc-29 8.55,0.25 1.03,4.43 arc-61 0,6.18 0,9.82 arc-61 1.03,11.57 8.55,15.75 arc-29 9.52,16 79,16 arc-90 81,14 81,2 arc-90
  pour Route3 (isolate 0.2, rank 5, no thermals): 79,0 9.52,0 arc-29 8.55,0.25 1.03,4.43 arc-61 0,6.18 0,9.82 arc-61 1.03,11.57 8.55,15.75 arc-29 9.52,16 79,16 arc-90 81,14 81,2 arc-90
  pour Top (isolate 0.15, rank 4): 69,6 73,6 73,12 69,12
  pour Top (isolate 0.2, rank 3, no thermals): 52.9,8 58.4,8 58.4,6.55 52.9,6.55
  pour Bottom (isolate 0.25, no thermals): 73.45,2.5 73.45,0.45 79.15,0.45 79.15,2.5
  pour Top (isolate 0.25, no thermals): 73.5,2.5 79.15,2.5 79.15,0.45 73.5,0.45
MCP1501_SHDN_N
  Top 0.25: R5.2 R6.1
  Top 0.35: U5.4 31.55,7.05 R6.1
OPAMP_IN+  (3 unrouted)
  Top 0.406: U2.5 43.5,6.78 43.75,6.2
V3.3D_CUTTABLE
  pour Top (isolate 0.25, no thermals): 58.8,7.3 60.45,7.3 60.45,4.2 58.8,4.2
V5D_CUTTABLE
  Top 0.35: U6.1 J35.1
VDD  (via drill 0.25, 0.25 pad 0.25)
  Top 0.15: D1.8 71.4,12.2 v71.65,12.8
  Top 0.35: 29.85,10.65 C15.2
  Top 0.5: U5.6 29.85,10.65 | C15.2 C14.2
  Top 0.6: 21.65,10.68 U4.6 | 21.7,10.76 U4.6 | 21.6,10.65 U4.6
  other vias: 54,11.8 54.95,9.45 54.35,9.45 53.8,9.45 54,11.25 54,10.7 31.95,8.9 31.35,8.9 21.65,12.45 21.35,12 21.95,12 21.6,8.9 21.3,9.45 21.9,9.45 40.4,9.6 40.95,9.6 41.5,9.6
  pour Route3 (isolate 0.2, rank 3, no thermals): 78,13.5 78,15.1 71.1,15.1 69.65,14.05 21,14.05 21.05,8.6 68.85,8.6 72.7,13.5
  pour Top (isolate 0.2, no thermals): 53.3,8.4 55.6,8.4 55.6,13.55 53.3,13.55
  pour Top (isolate 0.2): 29.3,9.3 29.3,8.7 30.8,8.7 31,8.5 31,7.8 32.2,7.8 32.2,9.3
  pour Top (isolate 0.2, rank 2, no thermals): 22.25,12.75 21.1,12.75 21.1,9.6 20.8,9.3 15.9,9.3 15.9,8.25 22.25,8.25
  pour Top (isolate 0.2, no thermals): 43,8.7 40.1,8.7 40.15,10.95 42.55,10.95 42.55,10.2 43,9.75
  pour Bottom (isolate 0.25, no thermals): 73.75,15.3 81,15.3 81,13.55 73.75,13.55
  pour Top (isolate 0.25, no thermals): 73.75,15.3 81,15.3 81,13.55 73.75,13.55
VIO  (via drill 0.25, 0.25 pad 0.25)
  Top 0.15: D1.7 71.95,10 v72.35,10.5
  other vias: 61.85,4 63.45,4.3 61.95,3.35 62.95,5.35 63.5,5 62.95,4.65
  pour Route3 (isolate 0.2, rank 2, no thermals): 78,12.6 73.2,12.6 68.25,5.9 60.7,5.9 60.7,2.9 68.7,2.85 73.9,11 78,11
  pour Top (isolate 0.25, no thermals): 61.25,5.85 61.25,3.05 65,3.1 65,5.9
  pour Bottom (isolate 0.25, no thermals): 73.7,12.55 80.95,12.55 80.95,11.05 73.7,11.05
  pour Top (isolate 0.25, no thermals): 73.75,12.55 80.95,12.55 80.95,11.05 73.75,11.05
VREF_FILTERED  (via drill 0.25, 1.1 pad 1.1)  (1 unrouted)
  Top 0.35: v25.45,3.8 24.7,4.6 C105.2 C1.2 C7.2 | v25.45,3.8 25.45,3.85 25.85,4.25 30.6,4.25 31.1,4 37.8,4 38.1,4.3 41.1,4.3 41.25,4.45 45,4.45 46.45,3 52.17,3 JP2.1 | C7.2 R18.2 R12.2 | C7.2 23.95,7.8 v23.9,7.85 | v20.15,12.15 20.35,11.95 20.35,10.85 20.4,10.8 20.36,10.77 U4.7 | J1.2 25,3.35 v25.45,3.8
  Top 0.5: U4.7 20.4,10.69
  Route3 0.35: v23.9,7.85 21.05,7.85 20.15,8.75 v20.15,12.15
VREF_OPTIONAL
  Top 0.35: TP1.TP 26.6,10.6 26.2,10.2 R12.1
VREF_OUT
  Top 0.35: U5.1 25.75,8.95 R18.1
VSHUNT_20X  (via drill 1.1 pad 1.1)
  Top 0.35: U4.5 22.99,11.24 23.2,11.25 26.05,11.25 26.35,11.55 33.25,11.55 33.25,9.35 33.1,9.2 R1.2 33.1,5.4 33.45,5.05 36.35,5.05 36.75,5.2 v36.9,5.3 J34.1
VSHUNT_20X_OUT
  Top 0.35: J34.2 47,5.3 47.2,5.4 47.4,5.55 49.62,5.55 JP2.3
VSHUNT_FILTERED  (via drill 0.25)
  Top 0.35: v48.8,7.85 48.8,11.85 48.7,11.95 46.5,11.95 J33.1
  Route3 0.35: JP2.5 48.36,7.41 v48.8,7.85
VSHUNT_FILTERED_ADC
  Top 0.35: J32.1 J33.2 45.35,12.6 C18.2 J31.2 TP14.TP
VSHUNT_FILTERED_M
  pour Top (isolate 0.2, rank 2, no thermals): 9.35,7.65 13.85,7.65 13.85,6.5 14.25,6.1 19.4,6.1 19.4,4.7 9.35,4.7
VSHUNT_FILTERED_P
  pour Top (isolate 0.2, rank 2, no thermals): 9.4,8.4 13.85,8.4 13.85,9.65 14.15,9.95 19.4,9.95 19.4,11.3 9.4,11.3
VSHUNT_M
  pour Top (no thermals): 0,7.6 8.7,7.65 8.7,5.25 0,5.2
VSHUNT_P
  pour Top (isolate 0.4, no thermals): 0,8.4 8.7,8.4 8.7,10.8 0,10.8

### Text on the board
tPlace: P | M
bPlace: V5D | V3.3D | P | IMON | CONV | V1.1 | M | VSHNT_F | VSHNT_20X | VREF_FIL | SCK | SDO | GND | GND
hints: Add pinout notation to top of board (at least V5D and GND) | Add tplace rectangle for annotation | Choose a terminal block, probably the black terminal block 3.5mm WM7877-ND